# EAGLE design flossjtag (EAGLE 7.4.0)
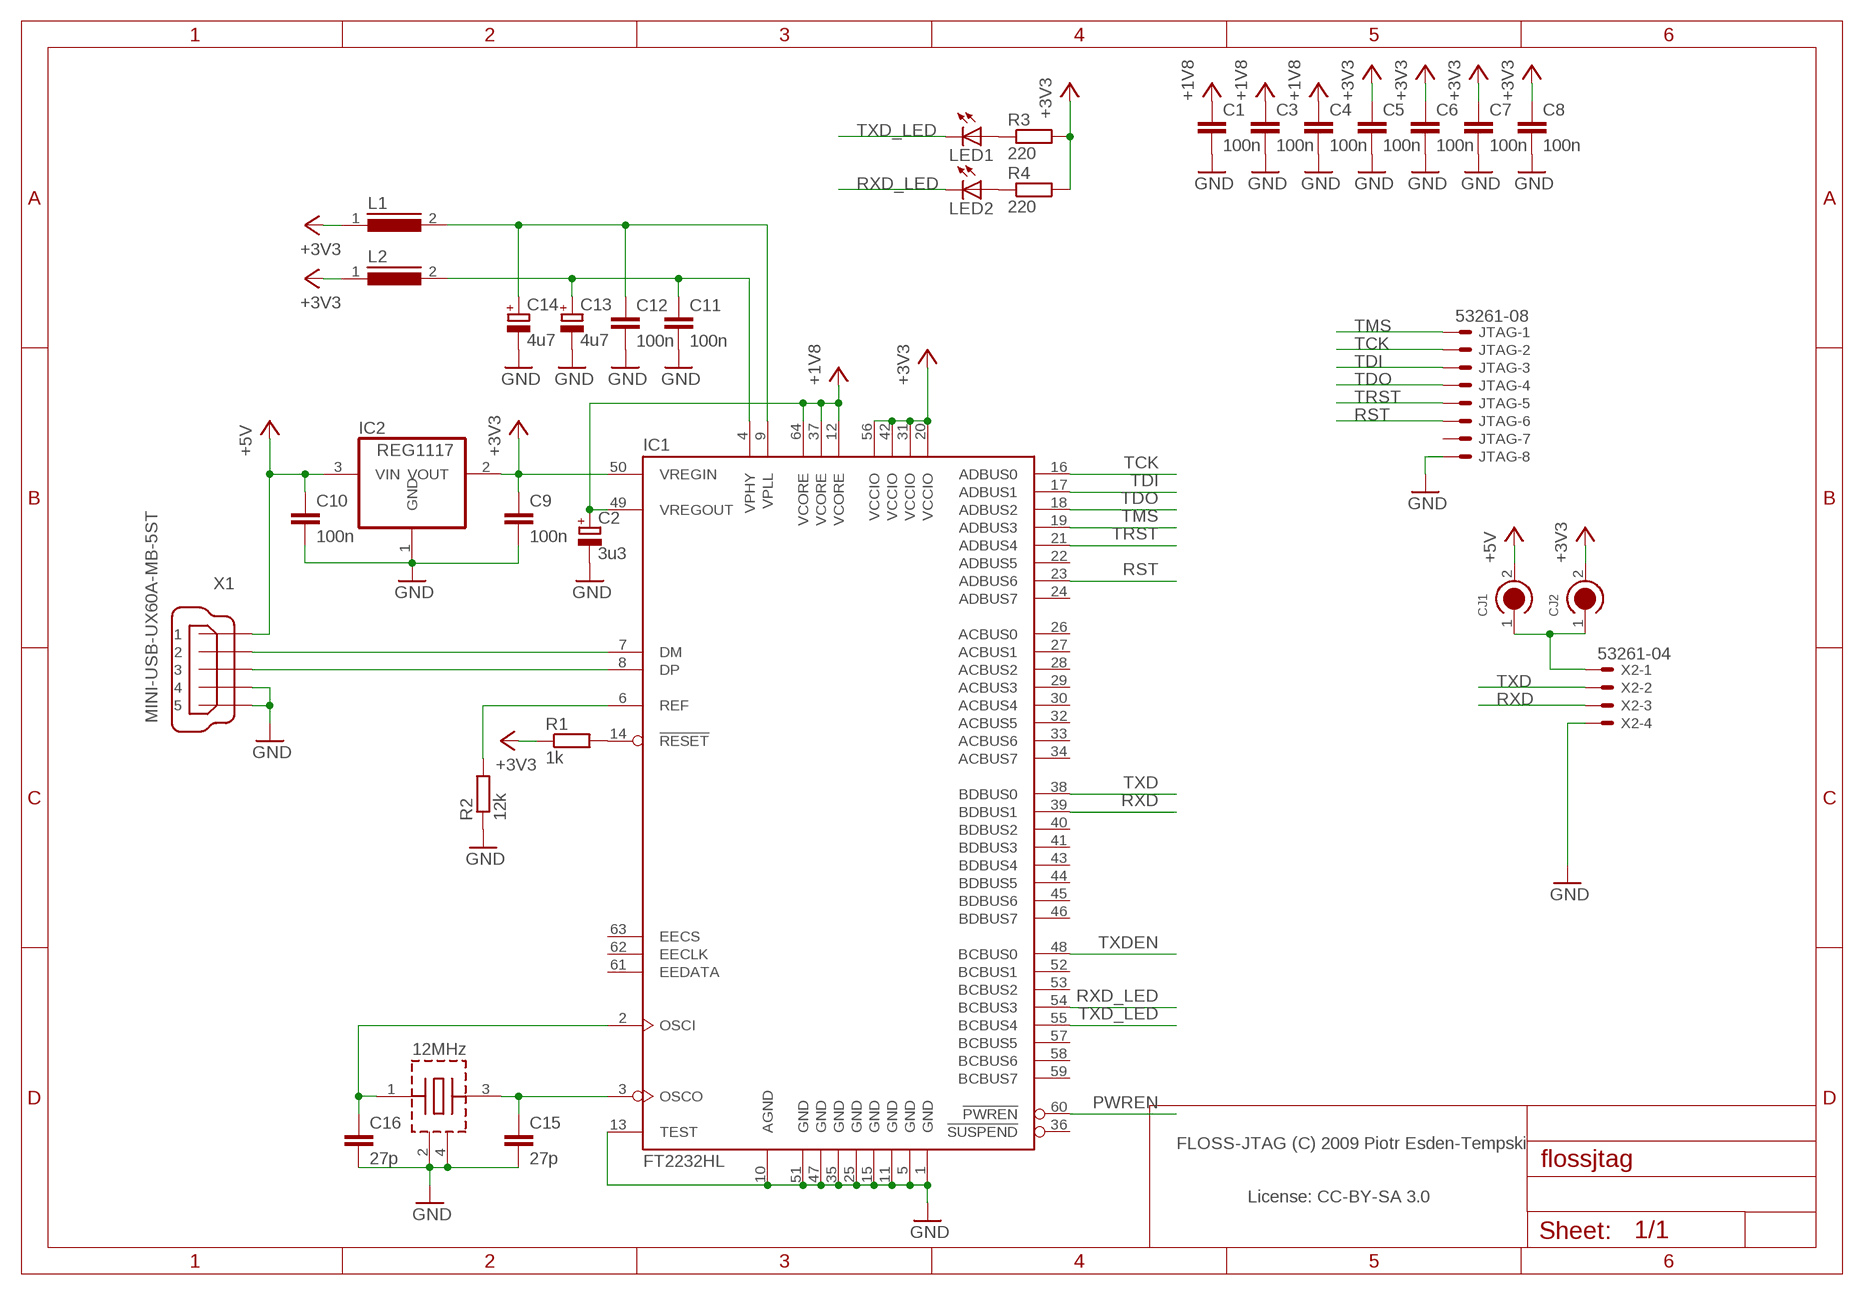
[diagram p0: schematic, sheet 1]

## Parts
C1  100n  C-EUC0603  [C0603]
C2  3u3  CPOL-EUA/3216-18R  [A/3216-18R]
C3  100n  C-EUC0603  [C0603]
C4  100n  C-EUC0603  [C0603]
C5  100n  C-EUC0603  [C0603]
C6  100n  C-EUC0603  [C0603]
C7  100n  C-EUC0603  [C0603]
C8  100n  C-EUC0603  [C0603]
C9  100n  C-EUC0603  [C0603]
C10  100n  C-EUC0603  [C0603]
C11  100n  C-EUC0603  [C0603]
C12  100n  C-EUC0603  [C0603]
C13  4u7  CPOL-EUA/3216-18R  [A/3216-18R]
C14  4u7  CPOL-EUA/3216-18R  [A/3216-18R]
C15  27p  C-EUC0603  [C0603]
C16  27p  C-EUC0603  [C0603]
CJ1  CIRC_JMP  [CIRC_JMP]
CJ2  CIRC_JMP  [CIRC_JMP]
IC1  FT2232HL  [LQFP64]
IC2  REG1117  [SOT223]
JTAG  53261-08  [53261-08]
L1  I0603  [R0603]
L2  I0603  [R0603]
LED1  LEDCHIP-LED0603  [CHIP-LED0603]
LED2  LEDCHIP-LED0603  [CHIP-LED0603]
R1  1k  R-EU_R0603  [R0603]
R2  12k  R-EU_R0603  [R0603]
R3  220  R-EU_R0603  [R0603]
R4  220  R-EU_R0603  [R0603]
X1  MINI-USB-UX60A-MB-5ST  [UX60A-MB-5ST]
X2  53261-04  [53261-04]
X3  12MHz  NX3225SA  [NX3225SA]

## Nets
+3V3: C5.1 C6.1 C7.1 C8.1 C9.1 CJ2.2 IC1.20(VCCIO) IC1.31(VCCIO) IC1.42(VCCIO) IC1.50(VREGIN) IC1.56(VCCIO) IC2.2(VOUT) L1.1 L2.1 R1.1 R3.2 R4.2
+5V: C10.1 CJ1.2 IC2.3(VIN) X1.1
GND: C1.2 C2.- C3.2 C4.2 C5.2 C6.2 C7.2 C8.2 C9.2 C10.2 C11.2 C12.2 C13.- C14.- C15.2 C16.2 IC1.1(GND) IC1.5(GND) IC1.10(AGND) IC1.11(GND) IC1.13(TEST) IC1.15(GND) IC1.25(GND) IC1.35(GND) IC1.47(GND) IC1.51(GND) IC2.1(GND) JTAG.8 R2.1 X1.4 X1.5 X2.4 X3.2(GND) X3.4(GND)
N$1: IC1.14(!RESET) R1.2
N$2: IC1.6(REF) R2.2
N$3: IC1.7(DM) X1.2
N$4: IC1.8(DP) X1.3
N$5: CJ1.1 CJ2.1 X2.1
N$6: C16.1 IC1.2(OSCI) X3.1(XTAL)
N$7: C12.1 C14.+ IC1.9(VPLL) L1.2
N$8: C11.1 C13.+ IC1.4(VPHY) L2.2
N$9: C15.1 IC1.3(OSCO) X3.3(XTAL)
N$10: LED1.A R3.1
N$11: LED2.A R4.1
PWREN: IC1.60(!PWREN)
RST: IC1.23(ADBUS6) JTAG.6
RXD: IC1.39(BDBUS1) X2.3
RXD_LED: IC1.54(BCBUS3) LED2.C
TCK: IC1.16(ADBUS0) JTAG.2
TDI: IC1.17(ADBUS1) JTAG.3
TDO: IC1.18(ADBUS2) JTAG.4
TMS: IC1.19(ADBUS3) JTAG.1
TRST: IC1.21(ADBUS4) JTAG.5
TXD: IC1.38(BDBUS0) X2.2
TXD_LED: IC1.55(BCBUS4) LED1.C
TXDEN: IC1.48(BCBUS0)
VCC: C1.1 C2.+ C3.1 C4.1 IC1.12(VCORE) IC1.37(VCORE) IC1.49(VREGOUT) IC1.64(VCORE) ; supply symbol labelled +1V8
Unconnected: IC1.22(ADBUS5) IC1.24(ADBUS7) IC1.26(ACBUS0) IC1.27(ACBUS1) IC1.28(ACBUS2) IC1.29(ACBUS3) IC1.30(ACBUS4) IC1.32(ACBUS5) IC1.33(ACBUS6) IC1.34(ACBUS7) IC1.36(!SUSPEND) IC1.40(BDBUS2) IC1.41(BDBUS3) IC1.43(BDBUS4) IC1.44(BDBUS5) IC1.45(BDBUS6) IC1.46(BDBUS7) IC1.52(BCBUS1) IC1.53(BCBUS2) IC1.57(BCBUS5) IC1.58(BCBUS6) IC1.59(BCBUS7) IC1.61(EEDATA) IC1.62(EECLK) IC1.63(EECS) JTAG.7

## Notes on the sheet
- FLOSS-JTAG (C) 2009 Piotr Esden-Tempski
- License: CC-BY-SA 3.0

## Library data of the parts
C1 C3-C12 C15 C16 = resistor:C-EU: CAPACITOR, European symbol
C2 C13 C14 = resistor:CPOL-EU: POLARIZED CAPACITOR, European symbol
CJ1 CJ2 = fancy_jumpers:CIRC_JMP
IC1 = ftdi:FT2232HL
IC2 = burr-brown:REG1117: 800mA and 1A Low Dropout (LDO) Positive Regulator 1.8V, 2.5V, 2.85V, 3.3V, 5V, and Adj
JTAG = con-molex:53?-08: CONNECTOR wire to board 1.25 mm (.049 inch) pitch header
L1 L2 = misc:I0603
LED1 LED2 = led:LED: LED OSRAM: - CHIPLED LG R971, LG N971, LY N971, LG Q971, LY Q971, LO R971, LY R971 LH N974, LH R974 LS Q976, LO Q976, LY Q976 LO Q996 - Hyper CHIPLED LW Q18S LB Q993, LB Q99A, LB R99A - SideLED LS A670, LO A670, LY A670, LG A670, LP A670 LB A673, LV A673, LT A673, LW A673 LH A674 LY A675 LS A676, LA A676, LO A676, LY A676, LW A676 LS A679, LY A679, LG A679 - Hyper Micro SIDELED® LS Y876, LA Y876, LO Y876, LY Y876 LT Y87S - SmartLED LW L88C, LW L88S LB L89C, LB L89S, LG L890 LS L89K, LO L89K, LY L89K LS L896, LA L896, LO L896, LY L896 - TOPLED LS T670, LO T670, LY T670, LG T670, LP T670 LSG T670, LSP T670, LSY T670, LOP T670, LYG T670 LG T671, LOG T671, LSG T671 LB T673, LV T673, LT T673, LW T673 LH T674 LS T676, LA T676, LO T676, LY T676, LB T676, LH T676, LSB T676, LW T676 LB T67C, LV T67C, LT T67C, LS T67K, LO T67K, LY T67K, LW E67C LS E67B, LA E67B, LO E67B, LY E67B, LB E67C, LV E67C, LT E67C LW T67C LS T679, LY T679, LG T679 LS T770, LO T770, LY T770, LG T770, LP T770 LB T773, LV T773, LT T773, LW T773 LH T774 LS E675, LA E675, LY E675, LS T675 LS T776, LA T776, LO T776, LY T776, LB T776 LHGB T686 LT T68C, LB T68C - Hyper Mini TOPLED® LB M676 - Mini TOPLED Santana® LG M470 LS M47K, LO M47K, LY M47K Source: http://www.osram.convergy.de LUXEON: - LUMILED® LXK2-PW12-R00, LXK2-PW12-S00, LXK2-PW14-U00, LXK2-PW14-V00 LXK2-PM12-R00, LXK2-PM12-S00, LXK2-PM14-U00 LXK2-PE12-Q00, LXK2-PE12-R00, LXK2-PE12-S00, LXK2-PE14-T00, LXK2-PE14-U00 LXK2-PB12-K00, LXK2-PB12-L00, LXK2-PB12-M00, LXK2-PB14-N00, LXK2-PB14-P00, LXK2-PB14-Q00 LXK2-PR12-L00, LXK2-PR12-M00, LXK2-PR14-Q00, LXK2-PR14-R00 LXK2-PD12-Q00, LXK2-PD12-R00, LXK2-PD12-S00 LXK2-PH12-R00, LXK2-PH12-S00 LXK2-PL12-P00, LXK2-PL12-Q00, LXK2-PL12-R00 Source: www.luxeon.com KINGBRIGHT: KA-3528ASYC Source: www.kingbright.com
R1-R4 = resistor:R-EU_: RESISTOR, European symbol
X1 = con-hirose:MINI-USB-: MINI USB Connector Source: http://www.hirose.co.jp/cataloge_hp/e24000019.pdf
X2 = con-molex:53?-04: CONNECTOR wire to board 1.25 mm (.049 inch) pitch header
X3 = misc:NX3225SA

## Board
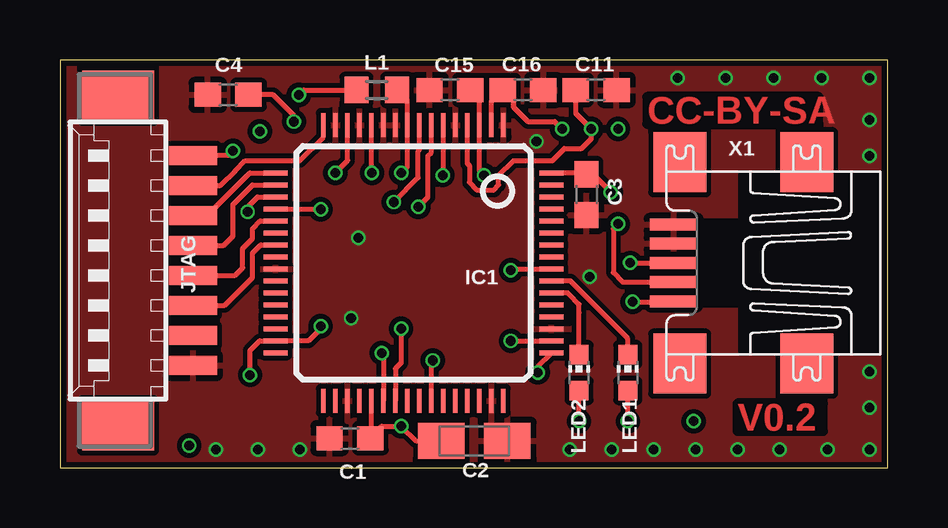
[diagram p1: board, top side]
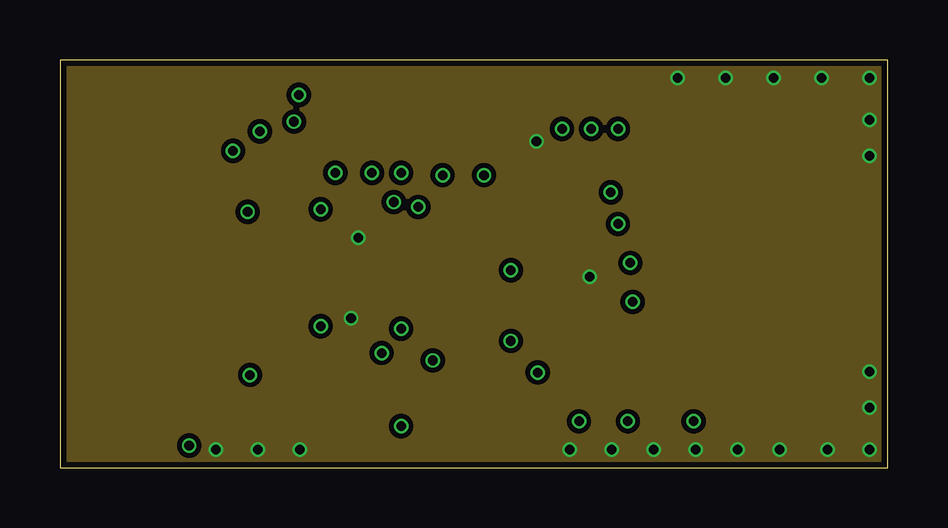
[diagram p2: board, inner layer Route2]
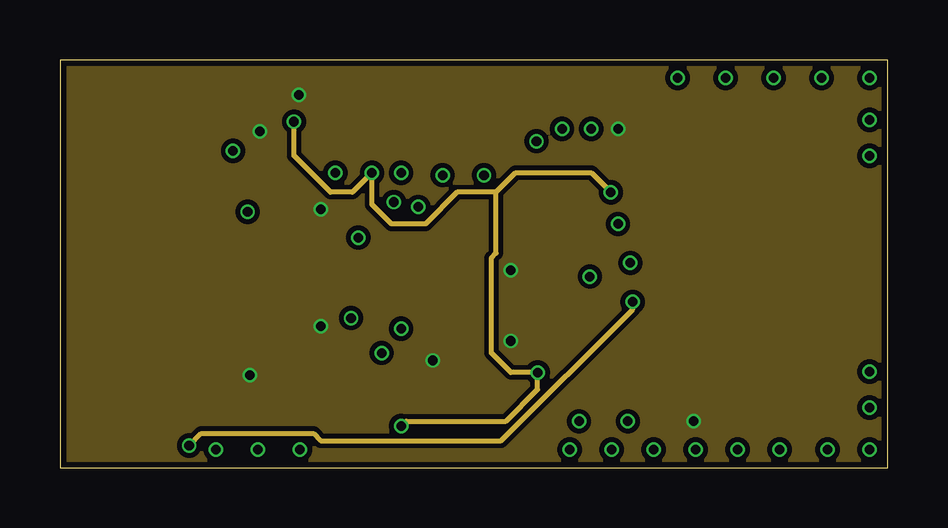
[diagram p3: board, inner layer Route15]
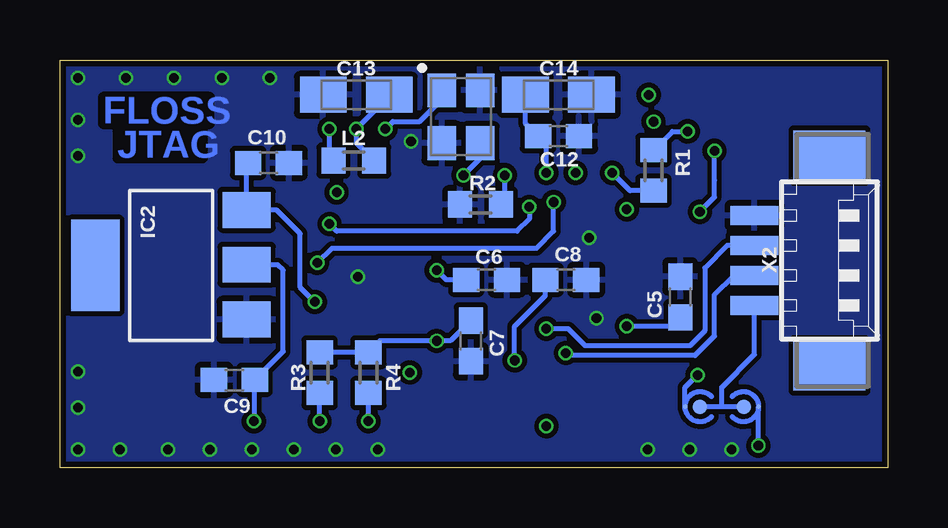
[diagram p4: board, bottom side, seen from below]

Size 34.5 x 17 mm. Coordinates in mm from the lower left corner, seen from the top.
Outline: 0,0 34.5,0 34.5,17 0,17 0,0
Copper layers (1*2+15*16): Top 0.035mm / dielectric 0.3mm / Route2 0.035mm / dielectric 0.15mm / Route15 0.035mm / dielectric 0.3mm / Bottom 0.035mm
Design rules "default *": minimum track width 7mil, minimum drill 0.4mm, track to track 8mil, track to pad 8mil, pad to pad 8mil, via to via 8mil, smd to smd 8mil, copper to edge 10mil, drill to drill 8mil, minimum pad ring 0.1mm, minimum via ring 0.1mm, stop-mask expansion 4mil, vias tented up to drill 0.4mm, thermal gap 10mil

### Footprints (pad centres in the part's own frame; a part is rotated, then mirrored left to right if it is on the bottom)
C0603 = smd 1.1 x 1: 1 -0.85,0; 2 0.85,0
A/3216-18R = smd 1.95 x 1.5: + 1.375,0; - -1.375,0
CIRC_JMP = smd 0.61 x 0.61: 1 0,0 | smd 0.203 x 0.203: 2 0,0.617
LQFP64 = smd 0.2 x 1: 1 -3.75,-5.75; 2 -3.25,-5.75; 3 -2.75,-5.75; 4 -2.25,-5.75; 5 -1.75,-5.75; 6 -1.25,-5.75; 7 -0.75,-5.75; 8 -0.25,-5.75; 9 0.25,-5.75; 10 0.75,-5.75; 11 1.25,-5.75; 12 1.75,-5.75; 13 2.25,-5.75; 14 2.75,-5.75; 15 3.25,-5.75; 16 3.75,-5.75; 33 3.75,5.75; 34 3.25,5.75; 35 2.75,5.75; 36 2.25,5.75; 37 1.75,5.75; 38 1.25,5.75; 39 0.75,5.75; 40 0.25,5.75; 41 -0.25,5.75; 42 -0.75,5.75; 43 -1.25,5.75; 44 -1.75,5.75; 45 -2.25,5.75; 46 -2.75,5.75; 47 -3.25,5.75; 48 -3.75,5.75 | smd 1 x 0.2: 17 5.75,-3.75; 18 5.75,-3.25; 19 5.75,-2.75; 20 5.75,-2.25; 21 5.75,-1.75; 22 5.75,-1.25; 23 5.75,-0.75; 24 5.75,-0.25; 25 5.75,0.25; 26 5.75,0.75; 27 5.75,1.25; 28 5.75,1.75; 29 5.75,2.25; 30 5.75,2.75; 31 5.75,3.25; 32 5.75,3.75; 49 -5.75,3.75; 50 -5.75,3.25; 51 -5.75,2.75; 52 -5.75,2.25; 53 -5.75,1.75; 54 -5.75,1.25; 55 -5.75,0.75; 56 -5.75,0.25; 57 -5.75,-0.25; 58 -5.75,-0.75; 59 -5.75,-1.25; 60 -5.75,-1.75; 61 -5.75,-2.25; 62 -5.75,-2.75; 63 -5.75,-3.25; 64 -5.75,-3.75
SOT223 = smd 1.499 x 2.007: 1 -2.261,-3.15; 2 0.025,-3.15; 3 2.311,-3.15 | smd 3.81 x 2.007: 4 0,3.15
53261-08 = smd 0.8 x 2: 1 4.375,-2.5; 2 3.125,-2.5; 3 1.875,-2.5; 4 0.625,-2.5; 5 -0.625,-2.5; 6 -1.875,-2.5; 7 -3.125,-2.5; 8 -4.375,-2.5 | smd 2.1 x 3: S1 6.875,0.625; S2 -6.875,0.625
R0603 = smd 1 x 1.1: 1 -0.85,0; 2 0.85,0
CHIP-LED0603 = smd 0.8 x 0.8: A 0,-0.75; C 0,0.75
UX60A-MB-5ST = smd 2 x 0.5: 1 2.25,1.6; 2 2.25,0.8; 3 2.25,0; 4 2.25,-0.8; 5 2.25,-1.6 | smd 2.2 x 2.5: M1 -3.3,-4.2; M2 -3.3,4.2; M3 2,4.2; M4 2,-4.2
53261-04 = smd 0.8 x 2: 1 1.875,-2.5; 2 0.625,-2.5; 3 -0.625,-2.5; 4 -1.875,-2.5 | smd 2.1 x 3: S1 4.375,0.625; S2 -4.375,0.625
NX3225SA = smd 1.4 x 1.2: 1 -1.1,-0.8; 2 1.1,-0.8; 3 1.1,0.8; 4 -1.1,0.8

### Placement (x,y rotation side)
C1  12.09,1.22 180 top
C2  17.27,1.12 180 top
C3  21.95,11.38 270 top
C4  7.01,15.54 180 top
C5  8.64,7.11 90 bottom
C6  16.71,7.82 0 bottom
C7  17.37,5.28 270 bottom
C8  13.41,7.82 0 bottom
C9  27.23,3.66 180 bottom
C10  25.81,12.7 0 bottom
C11  22.35,15.75 0 top
C12  13.72,13.82 0 bottom
C13  22.15,15.54 0 bottom
C14  13.72,15.54 180 bottom
C15  16.26,15.75 180 top
C16  19.3,15.75 0 top
CJ1  5.99,2.54 270 bottom
CJ2  7.82,2.54 90 bottom
IC1  14.73,8.53 180 top
IC2  29.87,8.43 90 bottom
JTAG  3.05,8.64 90 top
L1  13.21,15.75 0 top
L2  22.25,12.8 0 bottom
LED1  23.67,3.96 0 top
LED2  21.64,3.96 0 top
R1  9.75,12.4 270 bottom
R2  16.97,10.97 0 bottom
R3  23.67,3.96 90 bottom
R4  21.64,3.96 90 bottom
X1  27.84,8.53 180 top
X2  3.05,8.64 270 bottom
X3  17.78,14.63 270 bottom

### Tracks (layer width: path | path; a pad name or v marks a point on that pad's centre or on a via)
+3V3  (via drill 0.4)
  Top 0.203: v15.54,4.47 15.48,4.41 IC1.42 | IC1.50 v18.8,5.28 | v7.92,3.86 7.92,4.88 8.33,5.28 IC1.31 | v10.87,5.89 10.87,5.79 10.36,5.28 9.04,5.28 | v10.87,10.77 10.86,10.78 IC1.20 | v18.8,8.23 18.85,8.28 IC1.56 | v9.96,15.54 10.16,15.75 L1.1
  Bottom 0.203: C5.1 9.01,5.89 v10.87,5.89 | 17.1,5.86 C7.1 18.22,5.28 v18.8,5.28 21.17,5.28 R4.2 R3.2 | C6.1 18.39,7.82 v18.8,8.23 | C8.1 14.26,7.18 15.54,5.89 v15.54,4.47 | R1.1 8.98,14.02 v8.33,14.02 | IC2.2 25.43,8.46 25.2,8.23 25.2,4.84 C9.1 26.38,1.97 v26.42,1.93 | L2.1 23.27,12.97 v23.27,14.12 | CJ2.2 8.44,3.35 v7.92,3.86
  pour Route15: 0,0 34.5,0 34.5,17 0,17
+5V  (via drill 0.4)
  Top 0.203: X1.1 25.56,6.91 v23.88,6.91
  Route15 0.203: v23.88,6.91 23.88,6.6 18.39,1.12 10.87,1.12 10.57,1.42 5.89,1.42 v5.38,0.91
  Bottom 0.203: v23.88,6.91 24.49,7.52 24.49,9.75 25.48,10.74 IC2.3 26.72,12.64 C10.1 | v5.38,0.91 CJ1.2
GND  (via drill 0.4)
  other vias: 33.75,0.75 32,0.75 30,0.75 28.25,0.75 26.5,0.75 24.75,0.75 33.75,2.5 33.75,4 23,0.75 21.25,0.75 33.75,16.25 33.75,14.5 33.75,13 6.5,0.75 8.25,0.75 10,0.75 12.44,9.59 12.13,6.24 22.09,7.96 19.87,13.61 31.75,16.25 29.75,16.25 27.75,16.25 25.75,16.25
  pour Route2: 0,0 34.5,0 34.5,17 0,17
  pour Top: 0,0 34.5,0 34.5,17 0,17
  pour Bottom: 0,0 34.5,0 34.5,17 0,17
N$1  (via drill 0.4)
  Top 0.203: v11.48,12.29 12,12.81 11.98,12.83 IC1.14
  Bottom 0.203: R1.2 10.73,11.54 v11.48,12.29
N$2  (via drill 0.4)
  Top 0.203: IC1.6 15.98,12.22 v15.95,12.19
  Bottom 0.203: R2.2 16.05,11.04 15.95,11.14 v15.95,12.19
N$3  (via drill 0.4)
  Top 0.203: v14.94,10.87 15.34,11.28 15.34,13.01 15.48,13.14 IC1.7 | v23.27,10.16 23.06,9.96 23.06,8.13 23.46,7.73 X1.2
  Bottom 0.203: v14.94,10.87 14.94,10.36 15.44,9.86 22.96,9.86 v23.27,10.16
N$4  (via drill 0.4)
  Top 0.203: v13.92,11.07 14.94,12.09 14.94,13.21 14.98,13.26 IC1.8 | v23.77,8.53 X1.3
  Bottom 0.203: v13.92,11.07 13.92,9.86 14.63,9.14 23.16,9.14 v23.77,8.53
N$5
  Bottom 0.203: X2.1 5.55,4.71 6.91,3.35 6.91,2.54 | CJ1.1 6.91,2.54 | 6.91,2.54 CJ2.1
N$6  (via drill 0.4)
  Top 0.203: v20.93,14.12 20.62,14.43 19.51,14.43 18.9,15.04 18.9,15.14 18.9,15.3 C16.1 17.98,15.28 IC1.2
  Bottom 0.203: X3.1 18.58,15.35 19.51,14.43 20.62,14.43 v20.93,14.12
N$7  (via drill 0.4)
  Top 0.203: v14.22,12.29 14.48,12.55 IC1.9 14.48,15.32 L1.2
  Bottom 0.203: v14.22,12.29 14.22,13.53 14.52,13.82 C12.1 15.09,14.34 C14.+
N$8  (via drill 0.4)
  Top 0.203: C11.1 21.5,14.77 v22.15,14.12 22.15,13.72 21.74,13.31 21.03,13.31 20.52,12.8 18.9,12.8 18.29,12.19 18.29,11.79 18.09,11.58 17.37,11.58 17.07,11.89 17.07,12.6 16.98,12.69 IC1.4
  Bottom 0.203: L2.2 22.15,13.55 v22.15,14.12 20.77,15.5 C13.+
N$9  (via drill 0.4)
  Top 0.203: v17.68,12.19 17.48,12.39 IC1.3 17.48,15.37 C15.1
  Bottom 0.203: X3.3 16.98,12.89 v17.68,12.19
N$10  (via drill 0.4)
  Top 0.203: v23.67,1.93 LED1.A
  Bottom 0.203: v23.67,1.93 R3.1
N$11  (via drill 0.4)
  Top 0.203: v21.64,1.93 LED2.A
  Bottom 0.203: R4.1 LED2.A v21.64,1.93
RST
  Top 0.203: JTAG.6 6.86,6.76 8.03,7.92 8.03,8.94 8.37,9.28 IC1.23
RXD  (via drill 0.4)
  Top 0.203: v14.22,5.79 14.22,4.37 13.98,4.13 IC1.39
  Bottom 0.203: X2.3 6.69,9.26 7.62,8.33 7.62,5.69 8.23,5.08 12.6,5.08 13.31,5.79 v14.22,5.79
RXD_LED
  Top 0.203: LED2.C 21.64,6.46 21.64,6.81 21.23,7.21 21.16,7.28 IC1.54
TCK
  Top 0.203: IC1.16 10.98,13.78 10,12.8 7.92,12.8 7.72,12.8 7.32,12.39 6.68,11.76 JTAG.2
TDI
  Top 0.203: 8.97,12.29 IC1.17 7.92,12.28 7.82,12.19 6.14,10.51 JTAG.3
TDO
  Top 0.203: JTAG.4 6.82,9.26 7.21,9.65 7.21,10.97 8.03,11.78 IC1.18
TMS  (via drill 0.4)
  Top 0.203: v7.21,13.21 7.02,13.01 JTAG.1 | v7.82,10.67 7.82,10.87 8.13,11.18 8.24,11.28 IC1.19
  Bottom 0.203: v7.21,13.21 7.21,11.99 7.21,11.28 v7.82,10.67
TRST
  Top 0.203: JTAG.5 7.3,8.01 7.62,8.33 7.62,9.14 8.03,9.55 8.03,9.96 8.35,10.28 IC1.21
TXD  (via drill 0.4)
  Top 0.203: v13.41,4.78 13.48,4.7 IC1.38
  Bottom 0.203: X2.2 6.42,8.01 7.21,7.21 7.21,5.49 8.03,4.67 13.31,4.67 v13.41,4.78
TXD_LED
  Top 0.203: LED1.C 23.67,5.08 23.67,5.38 21.34,7.72 21.27,7.78 IC1.55
VCC  (via drill 0.4)
  Top 0.203: v9.75,14.43 9.75,14.67 8.88,15.54 C4.1 | C1.1 12.98,1.26 | 12.98,1.26 IC1.37 | 12.98,1.26 13.01,1.28 13.01,1.32 13.41,1.73 v14.22,1.73 14.83,1.12 C2.+ | IC1.49 19.91,4.22 v19.91,3.96 | v22.96,11.48 22.21,12.23 C3.1 21.89,12.28 IC1.64 | v13.01,12.29 12.98,12.32 IC1.12
  Route15 0.203: v9.75,14.43 9.75,13.01 11.28,11.48 12.19,11.48 v13.01,12.29 13.01,10.97 13.82,10.16 15.24,10.16 16.56,11.48 18.19,11.48 | 18.19,11.48 19,12.29 22.15,12.29 v22.96,11.48 | 18.19,11.48 18.19,8.94 17.98,8.74 17.98,4.78 18.8,3.96 v19.91,3.96 19.91,3.25 18.59,1.93 14.43,1.93 v14.22,1.73

### Text on the board
Top: CC-BY-SA | V0.2
Bottom: FLOSS | JTAG
tStop: CC-BY-SA | V0.2
bStop: FLOSS | JTAG